# EAGLE board PDU_v2.1 (EAGLE 9.6.2), part 1 of 2
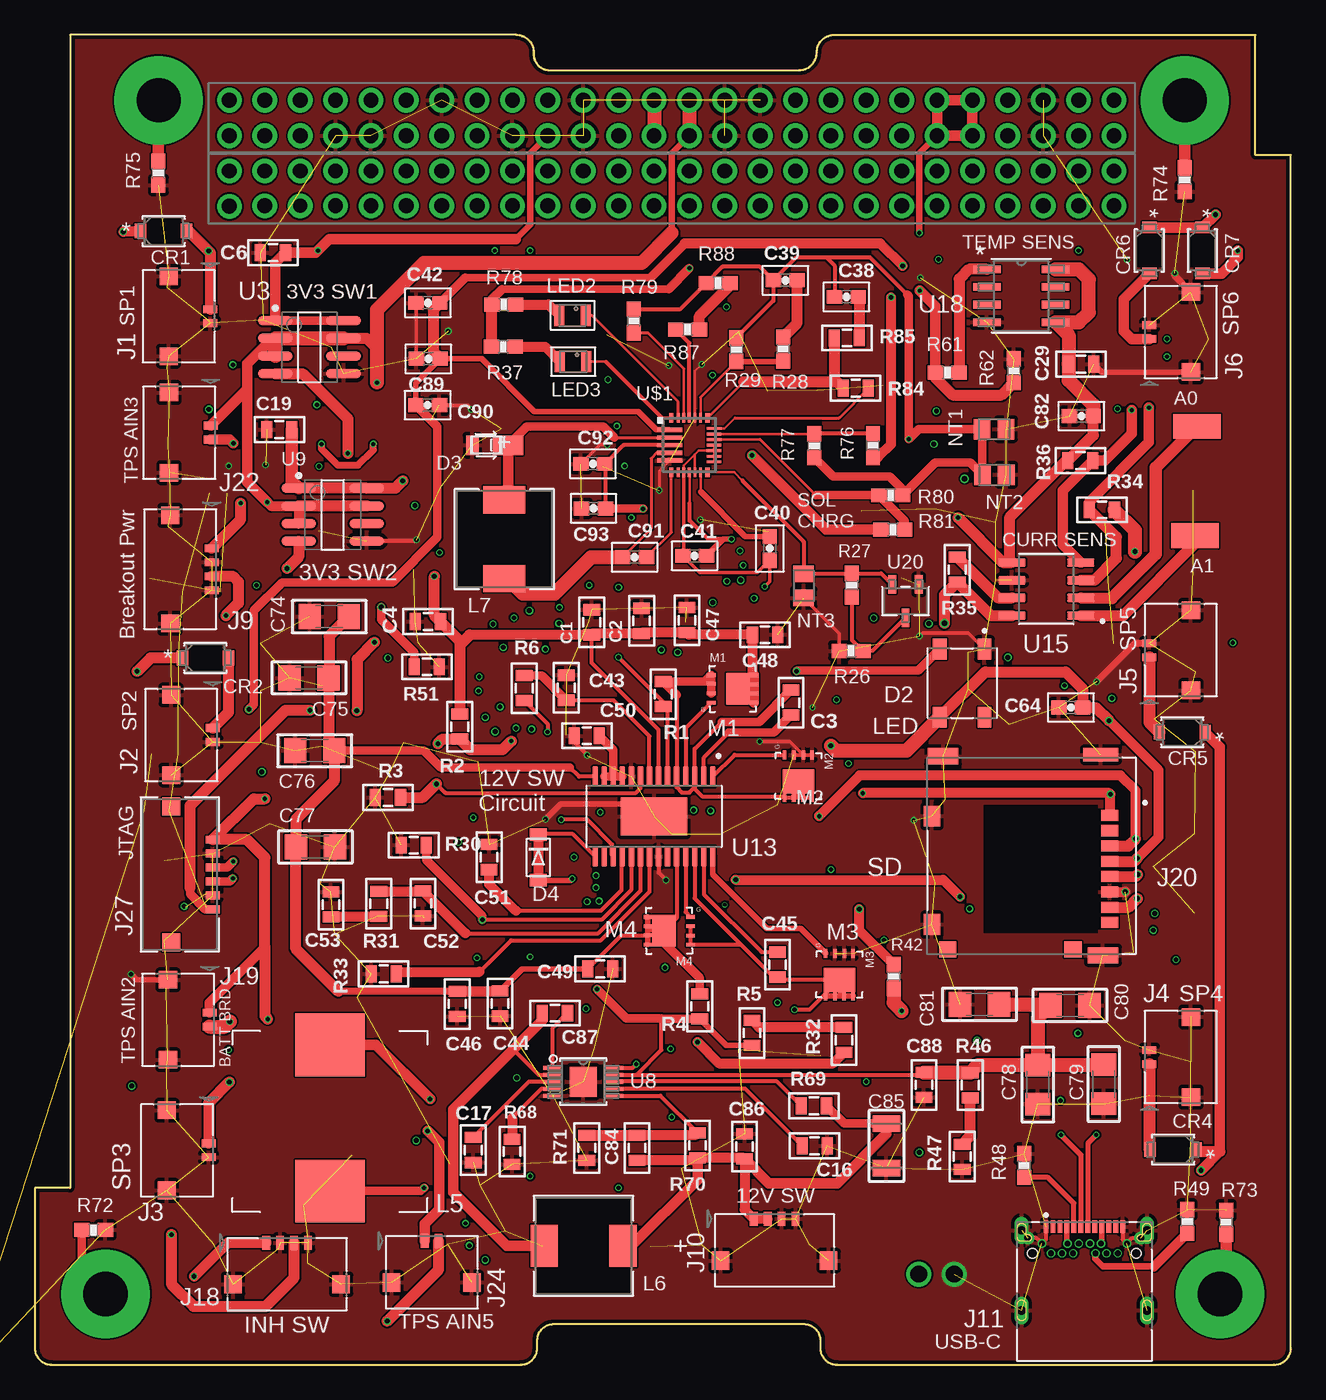
[diagram p12: board, top side]
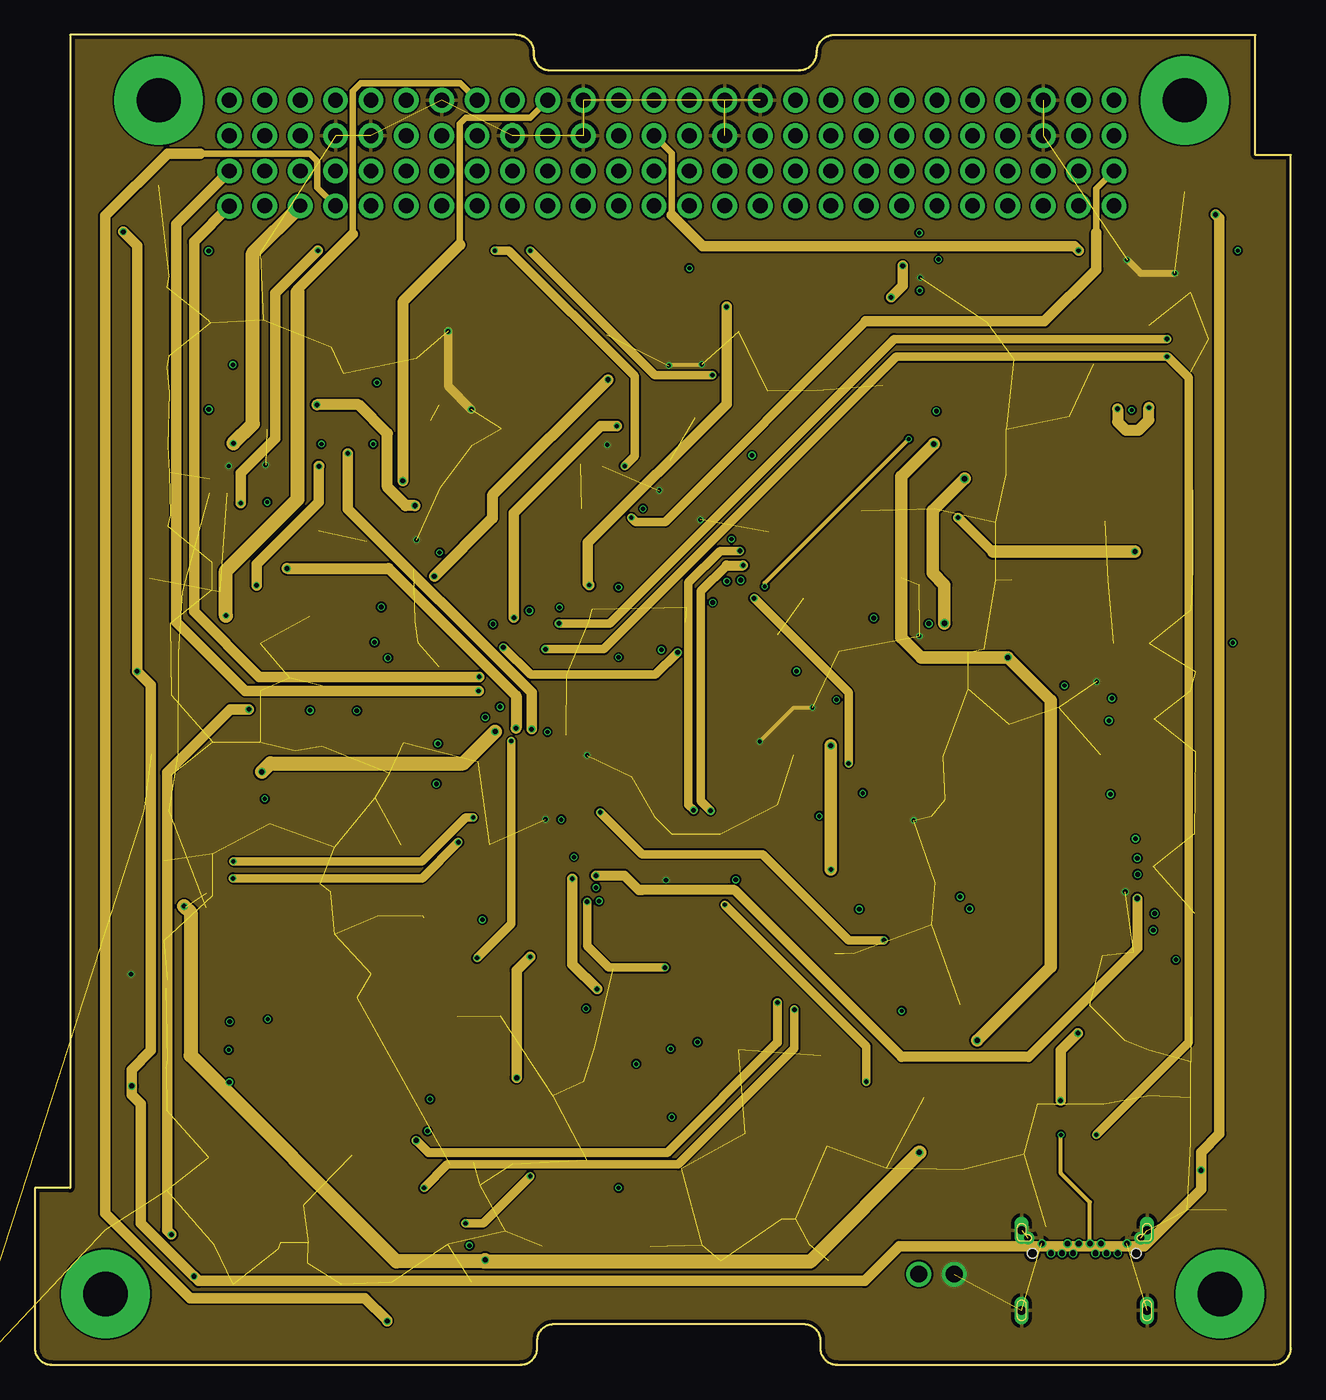
[diagram p13: board, inner layer Route2]
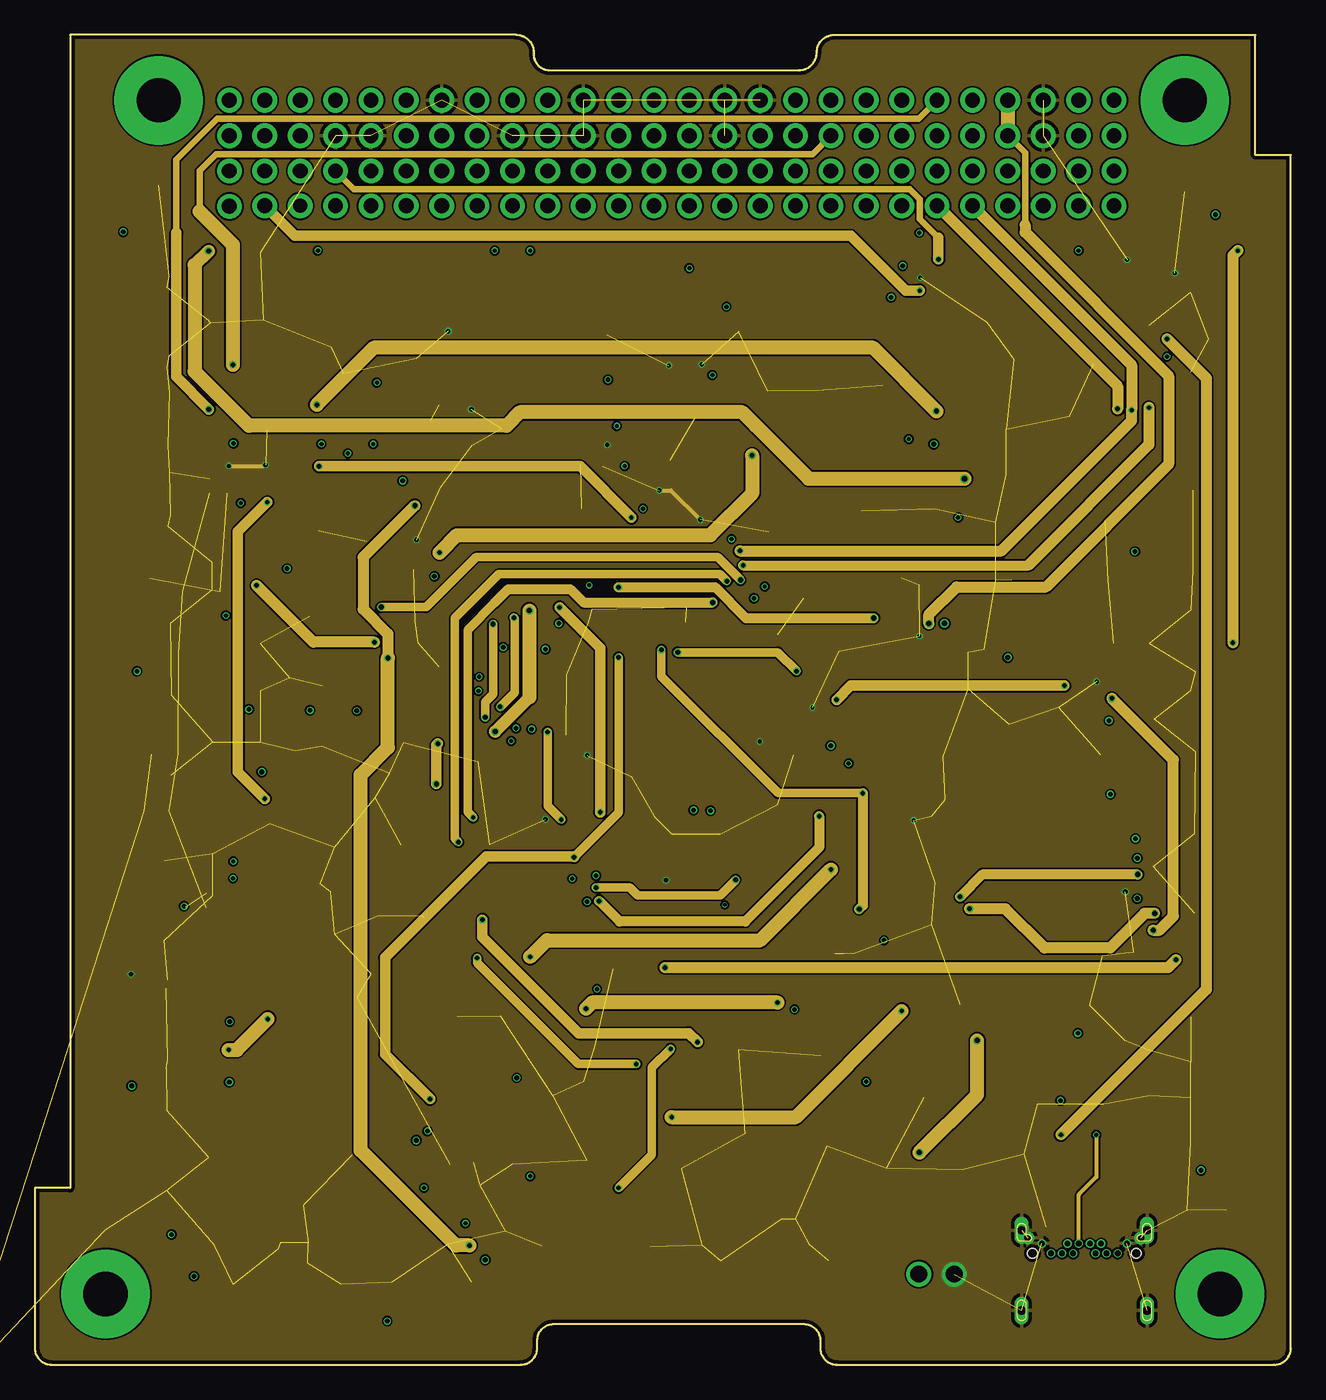
[diagram p14: board, inner layer Route15]
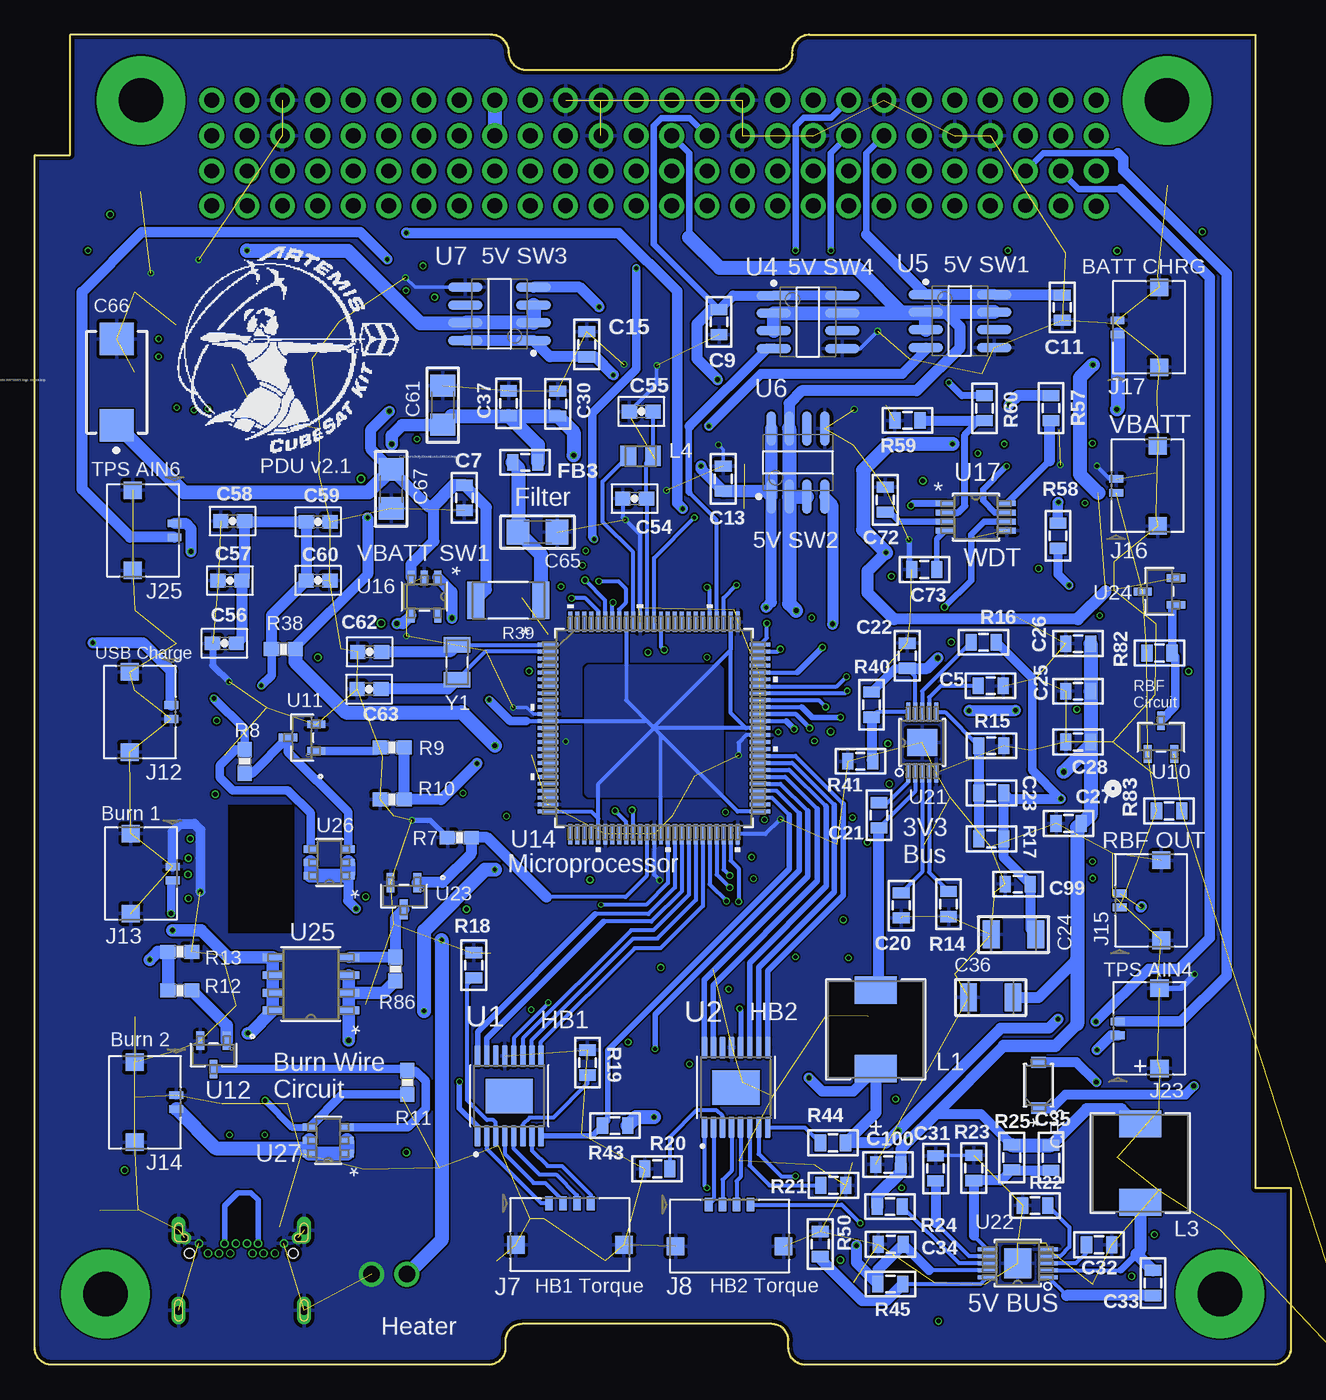
[diagram p15: board, bottom side, seen from below]

Size 90.17 x 95.5 mm. Coordinates in mm from the lower left corner, seen from the top.
Copper layers (1+2*15+16): Top 0.035mm / dielectric 1.5mm / Route2 0.035mm / dielectric 0.15mm / Route15 0.035mm / dielectric 0.2mm / Bottom 0.035mm
Design rules "default *": minimum track width 6mil, minimum drill 5mil, track to track 5mil, track to pad 5mil, pad to pad 5mil, via to via 5mil, smd to smd 5mil, copper to edge 10mil, drill to drill 5mil, minimum pad ring 1mil, minimum via ring 1mil, stop-mask expansion 0mil, vias tented up to drill 0mil, thermal gap 10mil

## Footprints (pad centres in the part's own frame; a part is rotated, then mirrored left to right if it is on the bottom)
0805 = smd 0.8 x 1.2: 1 -0.9,0; 2 0.9,0
1210 = smd 1.2 x 2: 1 -1.6,0; 2 1.6,0
0603-CAP = smd 1.1 x 1: 1 -0.85,0; 2 0.85,0
1206 = smd 1.6 x 1.8: 1 -1.4,0; 2 1.4,0
CAPMP7343X430N = smd 2.35 x 2.45: 1 -3.1,0; 2 3.1,0
CFP3_SOD123W_NEX = smd 0.813 x 1.041: 1 -1.651,0; 2 1.651,0
LED_1655 = smd 1.5 x 1: 1 -2.45,1.6; 2 -2.45,-1.6; 3 2.45,-1.6; 4 2.45,1.6
POWERDI-123 = smd 0.9 x 1.4: A -1.6,0 | smd 2.2 x 1.4: C 0.95,0
SOD-123FL = smd 0.91 x 1.22: A 1.637,0; C -1.637,0
PC104_WCONN = drill 1.067 pad 1.778: 1.1 13.97,83.185; 1.2 13.97,85.725; 1.3 16.51,83.223; 1.4 16.51,85.725; 1.6 19.05,85.725; 1.7 21.59,83.223; 1.8 21.59,85.725; 1.9 24.13,83.223; 1.10 24.13,85.725; 1.11 26.67,83.223; 1.12 26.67,85.725; 1.13 29.21,83.223; 1.14 29.21,85.725; 1.15 31.75,83.223; 1.16 31.75,85.725; 1.17 34.29,83.223; 1.18 34.29,85.725; 1.19 36.83,83.223; 1.20 36.83,85.725; 1.21 39.37,83.223; 1.22 39.37,85.725; 1.23 41.91,83.223; 1.24 41.91,85.725; 1.25 44.45,83.223; 1.26 44.45,85.725; 1.27 46.99,83.223; 1.28 46.99,85.725; 1.29 49.53,83.223; 1.30 49.53,85.725; 1.31 52.07,83.223; 1.32 52.07,85.725; 1.33 54.61,83.223; 1.34 54.61,85.725; 1.35 57.15,83.223; 1.36 57.15,85.725; 1.37 59.69,83.223; 1.38 59.69,85.725; 1.39 62.23,83.223; 1.40 62.23,85.725; 1.41 64.77,83.223; 1.42 64.77,85.725; 1.43 67.31,83.223; 1.44 67.31,85.725; 1.45 69.85,83.223; 1.46 69.85,85.725; 1.47 72.39,83.223; 1.48 72.39,85.725; 1.49 74.93,83.223; 1.50 74.93,85.725; 1.51 77.47,83.223; 1.52 77.47,85.725; 2.1 13.97,88.265; 2.2 13.97,90.805; 2.3 16.51,88.265; 2.4 16.51,90.805; 2.5 19.05,88.265; 2.6 19.05,90.805; 2.7 21.59,88.265; 2.8 21.59,90.805; 2.9 24.13,88.265; 2.10 24.13,90.805; 2.11 26.67,88.265; 2.12 26.67,90.805; 2.13 29.21,88.265; 2.14 29.21,90.805; 2.15 31.75,88.265; 2.16 31.75,90.805; 2.17 34.29,88.265; 2.18 34.29,90.805; 2.19 36.83,88.265; 2.20 36.83,90.805; 2.21 39.37,88.265; 2.22 39.37,90.805; 2.23 41.91,88.265; 2.24 41.91,90.805; 2.25 44.45,88.265; 2.26 44.45,90.805; 2.27 46.99,88.265; 2.28 46.99,90.805; 2.29 49.53,88.265; 2.30 49.53,90.805; 2.31 52.07,88.265; 2.32 52.07,90.805; 2.33 54.61,88.265; 2.34 54.61,90.805; 2.35 57.15,88.265; 2.36 57.15,90.805; 2.37 59.69,88.265; 2.38 59.69,90.805; 2.39 62.23,88.265; 2.40 62.23,90.805; 2.41 64.77,88.265; 2.42 64.77,90.805; 2.43 67.31,88.265; 2.44 67.31,90.805; 2.45 69.85,88.265; 2.46 69.85,90.805; 2.47 72.39,88.265; 2.48 72.39,90.805; 2.49 74.93,88.265; 2.50 74.93,90.805; 2.51 77.47,88.265; 2.52 77.47,90.805 | drill 1.016 pad 1.778: 1.5 19.05,83.223 | drill 3.175 pad 6.35: P$1 5.08,5.08; P$2 85.09,5.08; P$3 82.55,90.805; P$4 8.89,90.805
CON_5037630291 = smd 0.55 x 1: 1 0,0; 2 -1,0 | smd 1.26 x 1.3: 3 2.375,2.99; 4 -3.38,2.99
CON_5037630491 = smd 0.55 x 1: 1 0,0; 2 -1,0; 3 -2,0; 4 -3,0 | smd 1.26 x 1.3: 5 2.375,2.99; 6 -5.38,2.99
CUI_UJ31-CH-G1-SMT-TR = smd 0.35 x 0.89: A1 0,0; A2 0.5,0; A3 1,0; A4 1.5,0; A5 2,0; A6 2.5,0; A7 3,0; A8 3.5,0; A9 4,0; A10 4.5,0; A11 5,0; A12 5.5,0 | drill 0.4 pad 0.6: B1 5.8,-1.205; B2 5.15,-1.905; B3 4.35,-1.905; B4 3.95,-1.205; B5 3.55,-1.905; B6 3.15,-1.205; B7 2.35,-1.205; B8 1.95,-1.905; B9 1.55,-1.205; B10 1.15,-1.905; B11 0.35,-1.905; B12 -0.3,-1.205 | drill 0.6 pad 1 long: SH1 -1.75,-6.005; SH3 -1.75,-0.255; SH4 7.25,-6.005; SH6 7.25,-0.255 | drill 0.5 pad 0.9: SH2 -1.3,-0.805; SH5 6.8,-0.805 | hole 0.7: -0.975,-1.905; 6.475,-1.905
MOLEX_503182-1852 = smd 0.8 x 1.24: 1 -2.9,6.355; 2 -1.8,6.355; 3 -0.7,6.355; 4 0.4,6.355; 5 1.5,6.355; 6 2.6,6.355; 7 3.7,6.355; 8 4.8,6.355 | smd 1.16 x 1.2: DT 6.74,-5.275 | smd 0.95 x 2.5: P1 -7.245,5.725 | smd 1.15 x 2.2: P2 7.145,5.875; P3 -7.145,-5.605 | smd 1.5 x 1.15: P4 -2.84,-6.4; P5 4.94,-6.4 | smd 1.16 x 1.25: SW 6.74,3.725
CONN_503763-0691_MOL = smd 0.559 x 0.991: 1 2.5,-2.368; 2 1.5,-2.368; 3 0.5,-2.368; 4 -0.5,-2.368; 5 -1.5,-2.368; 6 -2.5,-2.368 | smd 1.295 x 1.27: 7 -4.875,0.622; 8 4.875,0.622
IND_222NLT_PUL = smd 1.956 x 2.997: 1 -2.825,0; 2 2.825,0
INDC2012X100N = smd 1.14 x 1.47: 1 -0.89,0; 2 0.89,0
7443551600 = smd 5 x 4.5: P$1 3,2; P$2 3,12.5
LED_0805 = smd 0.711 x 1.524: 1 0,0; 2 1.905,0
BSZ100N06LS3 = smd 0.635 x 0.254: P$1 0.127,0.66; P$2 0.127,1.321; P$3 0.127,2.007; P$4 0.127,2.642; P$5 3.175,2.642; P$6 3.175,1.981; P$7 3.175,1.321; P$8 3.175,0.66 | smd 1.702 x 2.261: P$9 2.032,1.651
INDC2012X105N = smd 1.2 x 1.47: 1 -0.86,0; 2 0.86,0
0603-RES = smd 1.1 x 1: 1 -0.85,0; 2 0.85,0
RESC5025X70N = smd 1.2 x 2.67: 1 -2.335,0; 2 2.335,0
SOP65P640X120-17N = smd 1.57 x 0.41: 1 -2.87,2.275; 2 -2.87,1.625; 3 -2.87,0.975; 4 -2.87,0.325; 5 -2.87,-0.325; 6 -2.87,-0.975; 7 -2.87,-1.625; 8 -2.87,-2.275; 9 2.87,-2.275; 10 2.87,-1.625; 11 2.87,-0.975; 12 2.87,-0.325; 13 2.87,0.325; 14 2.87,0.975; 15 2.87,1.625; 16 2.87,2.275 | smd 2.48 x 3.4: 17 0,0
LINEAR_TECHNOLOGY_LTC1477CS8_2 = smd 2.5 x 0.7: 1 -2.45,1.905; 2 -2.45,0.635; 3 -2.45,-0.635; 4 -2.45,-1.905; 5 2.45,-1.905; 6 2.45,-0.635; 7 2.45,0.635; 8 2.45,1.905
MSOP-10_MSE = smd 1.397 x 0.279: 1 -2.184,1.001; 2 -2.184,0.5; 3 -2.184,0; 4 -2.184,-0.5; 5 -2.184,-1.001; 6 2.184,-1.001; 7 2.184,-0.5; 8 2.184,0; 9 2.184,0.5; 10 2.184,1.001 | smd 1.93 x 2.159: 11 0,0
SOT-23-3L_AOS = smd 0.559 x 1.321: 1 -0.953,-1.194; 2 0.953,-1.194; 3 0,1.194
PG-TO23-3_INF = smd 0.559 x 1.321: 1 -0.953,-1.016; 2 0.953,-1.016; 3 0,1.016
SOP65P640X120-29N = smd 1.48 x 0.41: 1 -2.865,4.225; 2 -2.865,3.575; 3 -2.865,2.925; 4 -2.865,2.275; 5 -2.865,1.625; 6 -2.865,0.975; 7 -2.865,0.325; 8 -2.865,-0.325; 9 -2.865,-0.975; 10 -2.865,-1.625; 11 -2.865,-2.275; 12 -2.865,-2.925; 13 -2.865,-3.575; 14 -2.865,-4.225; 15 2.865,-4.225; 16 2.865,-3.575; 17 2.865,-2.925; 18 2.865,-2.275; 19 2.865,-1.625; 20 2.865,-0.975; 21 2.865,-0.325; 22 2.865,0.325; 23 2.865,0.975; 24 2.865,1.625; 25 2.865,2.275; 26 2.865,2.925; 27 2.865,3.575; 28 2.865,4.225 | smd 2.74 x 4.75: 29 0,0
TQFP100_14X14MC_MCH = smd 1.473 x 0.279: 1 -7.62,6; 2 -7.62,5.5; 3 -7.62,5; 4 -7.62,4.5; 5 -7.62,4; 6 -7.62,3.5; 7 -7.62,3; 8 -7.62,2.5; 9 -7.62,2; 10 -7.62,1.5; 11 -7.62,1; 12 -7.62,0.5; 13 -7.62,0; 14 -7.62,-0.5; 15 -7.62,-1; 16 -7.62,-1.5; 17 -7.62,-2; 18 -7.62,-2.5; 19 -7.62,-3; 20 -7.62,-3.5; 21 -7.62,-4; 22 -7.62,-4.5; 23 -7.62,-5; 24 -7.62,-5.5; 25 -7.62,-6; 51 7.62,-6; 52 7.62,-5.5; 53 7.62,-5; 54 7.62,-4.5; 55 7.62,-4; 56 7.62,-3.5; 57 7.62,-3; 58 7.62,-2.5; 59 7.62,-2; 60 7.62,-1.5; 61 7.62,-1; 62 7.62,-0.5; 63 7.62,0; 64 7.62,0.5; 65 7.62,1; 66 7.62,1.5; 67 7.62,2; 68 7.62,2.5; 69 7.62,3; 70 7.62,3.5; 71 7.62,4; 72 7.62,4.5; 73 7.62,5; 74 7.62,5.5; 75 7.62,6 | smd 0.279 x 1.473: 26 -6,-7.62; 27 -5.5,-7.62; 28 -5,-7.62; 29 -4.5,-7.62; 30 -4,-7.62; 31 -3.5,-7.62; 32 -3,-7.62; 33 -2.5,-7.62; 34 -2,-7.62; 35 -1.5,-7.62; 36 -1,-7.62; 37 -0.5,-7.62; 38 0,-7.62; 39 0.5,-7.62; 40 1,-7.62; 41 1.5,-7.62; 42 2,-7.62; 43 2.5,-7.62; 44 3,-7.62; 45 3.5,-7.62; 46 4,-7.62; 47 4.5,-7.62; 48 5,-7.62; 49 5.5,-7.62; 50 6,-7.62; 76 6,7.62; 77 5.5,7.62; 78 5,7.62; 79 4.5,7.62; 80 4,7.62; 81 3.5,7.62; 82 3,7.62; 83 2.5,7.62; 84 2,7.62; 85 1.5,7.62; 86 1,7.62; 87 0.5,7.62; 88 0,7.62; 89 -0.5,7.62; 90 -1,7.62; 91 -1.5,7.62; 92 -2,7.62; 93 -2.5,7.62; 94 -3,7.62; 95 -3.5,7.62; 96 -4,7.62; 97 -4.5,7.62; 98 -5,7.62; 99 -5.5,7.62; 100 -6,7.62
SOIC127P599X175-8N = smd 1.97 x 0.6: 1 -2.47,1.905; 2 -2.47,0.635; 3 -2.47,-0.635; 4 -2.47,-1.905; 5 2.47,-1.905; 6 2.47,-0.635; 7 2.47,0.635; 8 2.47,1.905
SOT-23-5_M5_MCH = smd 0.978 x 0.508: 1 -1.365,0.95; 2 -1.365,0; 3 -1.365,-0.95; 4 1.365,-0.95; 5 1.365,0.95
21-0036K_MXM = smd 1.321 x 0.406: 1 -2.21,0.975; 2 -2.21,0.325; 3 -2.21,-0.325; 4 -2.21,-0.975; 5 2.21,-0.975; 6 2.21,-0.325; 7 2.21,0.325; 8 2.21,0.975
R_8_ADI = smd 1.981 x 0.559: 1 -2.464,1.905; 2 -2.464,0.635; 3 -2.464,-0.635; 4 -2.464,-1.905; 5 2.464,-1.905; 6 2.464,-0.635; 7 2.464,0.635; 8 2.464,1.905
SOT-23_ONS = smd 0.559 x 1.422: 1 -0.953,-0.965; 2 0.953,-0.965; 3 0,0.965
SOIC_DY-T1-GE3_VIS = smd 1.46 x 0.559: 1 -2.724,1.905; 2 -2.724,0.635; 3 -2.724,-0.635; 4 -2.724,-1.905; 5 2.724,-1.905; 6 2.724,-0.635; 7 2.724,0.635; 8 2.724,1.905
6TSOP_VIS = smd 0.991 x 0.508: 1 -1.346,0.95; 2 -1.346,0; 3 -1.346,-0.95; 4 1.346,-0.95; 5 1.346,0; 6 1.346,0.95
QFN26-4X4_MP2639A = smd 1.8 x 0.3: 1 -1.4,1.1; 2 -1.4,0.55; 3 -1.4,0; 4 -1.4,-0.55; 5 -1.4,-1.1 | smd 0.3 x 0.7: 6 -1.3,-1.95; 12 1.3,-1.95; 20 1.3,1.95; 26 -1.3,1.95 | smd 0.2 x 0.7: 7 -0.8,-1.95; 8 -0.4,-1.95; 9 0,-1.95; 10 0.4,-1.95; 11 0.8,-1.95; 21 0.8,1.95; 22 0.4,1.95; 23 0,1.95; 24 -0.4,1.95; 25 -0.8,1.95 | smd 1.05 x 0.2: 13 1.775,-1.2; 14 1.775,-0.8; 15 1.775,-0.4; 16 1.775,0; 17 1.775,0.4; 18 1.775,0.8; 19 1.775,1.2
TEST_POINT = smd 3.429 x 1.778: 1 0,0
XTAL_ABS07-32.768KHZ-T = smd 1.1 x 1.9: 1 -1.25,0; 2 1.25,0

## Placement (x,y rotation side)
C1  22 uF  [0805]  39.98,53.31 90 top
C2  22 uF  [0805]  43.56,53.42 90 top
C3  0.1 uF  [0805]  54.28,47.55 270 top
C4  1 uF  [0805]  28.22,53.37 180 top
C5  0.1 uF  [0805]  21.55,48.75 0 bottom
C6  1 uF  [0805]  17.09,79.86 180 top
C7  0.1 uF  [0805]  59.33,62.26 270 bottom
C9  1 uF  [0805]  41.05,74.88 270 bottom
C11  1 uF  [0805]  16.41,75.92 270 bottom
C13  1 uF  [0805]  40.74,63.63 90 bottom
C15  1 uF  [0805]  50.55,73.28 90 bottom
C16  0.1 uF  [0805]  55.98,15.72 0 top
C17  1 uF  [0805]  31.47,15.42 270 top
C19  1 uF  [0805]  17.55,67.16 180 top
C20  1 uF  [0805]  27.97,32.98 270 bottom
C21  0.1 uF  [0805]  29.57,39.45 270 bottom
C22  4.7 uF  [0805]  27.54,50.91 90 bottom
C23  10 pF  [0805]  21.51,41.06 0 bottom
C24  47 uF  [1210]  19.91,30.89 180 bottom
C25  0.1 uF  [0805]  15.27,48.37 0 bottom
C26  10 uF  [0805]  15.27,51.78 0 bottom
C27  0.1 uF  [0805]  15.96,38.87 0 bottom
C28  10 uF  [0805]  15.27,44.71 0 bottom
C29  0.1 uF  [0805]  75.11,71.86 0 top
C30  1 uF  [0805]  52.63,69.01 90 bottom
C31  0.1 uF  [0805]  25.5,14.1 90 bottom
C32  1 uF  [0805]  13.77,8.61 0 bottom
C33  0.1 uF  [0805]  9.91,5.87 90 bottom
C34  4.7 uF  [0805]  28.73,8.64 180 bottom
C35  10 pF  [0805]  17.22,14.86 90 bottom
C36  47 uF  [1210]  21.54,26.37 180 bottom
C37  0.1 uF  [0805]  56.16,69.04 90 bottom
C38  1 uF  [0603-CAP]  58.27,76.68 0 top
C39  33 pF  [0603-CAP]  53.87,77.88 0 top
C40  0.1 uF  [0603-CAP]  52.76,58.62 270 top
C41  1 uF  [0603-CAP]  47.37,58.09 180 top
C42  4.7 uF  [0603-CAP]  28.22,76.25 0 top
C43  4.7 uF  [0805]  38.15,48.62 90 top
C44  1uF  [0805]  33.4,25.93 270 top
C45  0.1 uF  [0805]  53.31,28.73 90 top
C46  10 uF  [0805]  30.33,25.91 270 top
C47  4.7 uF  [0805]  46.81,53.47 90 top
C48  4.7 uF  [0805]  52.43,52.43 0 top
C49  10 uF  [0805]  40.59,28.42 0 top
C50  0.47 uF  [0805]  39.62,45.16 180 top
C51  0.1 uF  [0805]  32.61,36.45 90 top
C52  100 pF  [0805]  27.86,33.12 270 top
C53  4.7 nF  [0805]  21.26,33.05 90 top
C54  10 uF  [0603-CAP]  47.12,62.2 180 bottom
C55  1 uF  [0603-CAP]  46.63,68.45 180 bottom
C56  10 uF  [0603-CAP]  76.56,51.81 180 bottom
C57  1 uF  [0603-CAP]  76.17,56.31 180 bottom
C58  1 uF  [0603-CAP]  75.97,60.59 180 bottom
C59  0.1 uF  [0603-CAP]  69.82,60.53 0 bottom
C60  0.1 uF  [0603-CAP]  69.83,56.32 0 bottom
C61  4.7 uF  [1206]  60.88,68.91 90 bottom
C62  22 pF  [0603-CAP]  66.14,51.19 0 bottom
C63  22 pF  [0603-CAP]  66.18,48.51 0 bottom
C64  0.1 uF  [0603-CAP]  74.37,47.19 180 top
C65  4.7 uF  [1206]  54.08,59.79 0 bottom
C66  22 uF  [CAPMP7343X430N]  84.28,70.56 90 bottom
C67  4.7 uF  [1206]  64.59,62.89 270 bottom
C72  0.1 uF  [0805]  29.13,62.12 270 bottom
C73  1 uF  [0805]  26.31,57.1 180 bottom
C74  33 uF  [1206]  21.13,53.72 180 top
C75  33 uF  [1206]  19.68,49.33 180 top
C76  33 uF  [1206]  20.09,44.09 180 top
C77  33 uF  [1206]  20.14,37.19 0 top
C78  33 uF  [1206]  72.01,20.12 270 top
C79  33 uF  [1206]  76.73,20.14 270 top
C80  33 uF  [1206]  74.32,25.81 0 top
C81  33 uF  [1206]  67.82,25.88 180 top
C82  0.1 uF  [0603-CAP]  75.13,68.12 0 top
C84  10 pF  [0805]  43.23,15.57 270 top
C85  47 uF  [1210]  61.14,15.72 270 top
C86  4.7 uF  [0805]  50.95,15.67 90 top
C87  0.1 uF  [0805]  37.34,25.25 180 top
C88  4.7 uF  [0805]  63.83,20.09 270 top
C89  10 uF  [0603-CAP]  28.24,72.24 0 top
C90  4.7 uF  [0603-CAP]  28.19,68.91 180 top
C91  0.1 uF  [0603-CAP]  43.05,57.99 0 top
C92  10 uF  [0603-CAP]  40.06,64.69 0 top
C93  1 uF  [0603-CAP]  40.11,61.49 0 top
C99  4.7 uF  [0805]  19.6,34.51 180 bottom
C100  4.7 uF  [0805]  28.91,14.38 180 bottom
CR1  PMEG10020ELRX  [CFP3_SOD123W_NEX]  9.25,81.41 0 top
CR2  PMEG10020ELRX  [CFP3_SOD123W_NEX]  12.24,50.75 0 top
CR3  PMEG10020ELRX  [CFP3_SOD123W_NEX]  18.11,20.07 90 bottom
CR4  PMEG10020ELRX  [CFP3_SOD123W_NEX]  81.71,15.44 180 top
CR5  PMEG10020ELRX  [CFP3_SOD123W_NEX]  82.37,45.42 180 top
CR6  PMEG10020ELRX  [CFP3_SOD123W_NEX]  80.01,80.01 270 top
CR7  PMEG10020ELRX  [CFP3_SOD123W_NEX]  83.82,80.01 270 top
D2  1655  [LED_1655]  66.57,48.95 270 top
D3  SBR2A40P1Q-7  [POWERDI-123]  33.02,66.04 0 top
D4  [SOD-123FL]  36.14,36.42 270 top
FB3  330  [0805]  54.97,64.8 180 bottom
H1  PC104_WCONN  [PC104_WCONN]  0,0 0 top
J1  5037630291  [CON_5037630291]  12.6,75.79 90 top
J2  5037630291  [CON_5037630291]  12.78,45.72 90 top
J3  5037630291  [CON_5037630291]  12.47,15.9 90 top
J4  5037630291  [CON_5037630291]  80.01,21.59 270 top
J5  5037630291  [CON_5037630291]  80.01,50.8 270 top
J6  5037630291  [CON_5037630291]  80.01,73.66 270 top
J7  5037630491  [CON_5037630491]  53.26,11.6 180 bottom
J8  5037630491  [CON_5037630491]  41.79,11.5 180 bottom
J9  5037630491  [CON_5037630491]  12.7,58.62 90 top
J10  5037630491  [CON_5037630491]  51.61,10.46 180 top
J11  UJ31-CH-G1-SMT-TR  [CUI_UJ31-CH-G1-SMT-TR]  72.59,9.91 0 top
J12  5037630291  [CON_5037630291]  80.37,47.37 90 bottom
J13  5037630291  [CON_5037630291]  80.28,35.77 90 bottom
J14  5037630291  [CON_5037630291]  80.01,19.35 90 bottom
J15  5037630291  [CON_5037630291]  12.29,32.84 270 bottom
J16  5037630291  [CON_5037630291]  12.55,62.61 270 bottom
J17  5037630291  [CON_5037630291]  12.45,74 270 bottom
J18  5037630491  [CON_5037630491]  16.61,8.76 180 top
J19  5037630291  [CON_5037630291]  12.55,25.27 90 top
J20  503182-1852  [MOLEX_503182-1852]  70.81,36.55 270 top
J22  5037630291  [CON_5037630291]  12.62,67.44 90 top
J23  5037630291  [CON_5037630291]  12.42,23.65 270 bottom
J24  5037630291  [CON_5037630291]  27.99,8.89 180 top
J25  5037630291  [CON_5037630291]  80.15,60.43 90 bottom
J27  5037630691  [CONN_503763-0691_MOL]  10.41,35.2 90 top
L1  PA4341.222NLT  [IND_222NLT_PUL]  29.79,24.08 90 bottom
L3  PA4341.222NLT  [IND_222NLT_PUL]  10.82,14.48 270 bottom
L4  10 uH  [INDC2012X100N]  46.69,65.25 180 bottom
L5  6 uH  [7443551600]  24.18,24.97 180 top
L6  PA4341.222NLT  [IND_222NLT_PUL]  39.4,8.53 180 top
L7  PA4341.222NLT  [IND_222NLT_PUL]  33.71,59.28 270 top
LED2  LED_0805  [LED_0805]  37.64,75.36 0 top
LED3  LED_0805  [LED_0805]  37.69,72.03 0 top
M1  BSZ100N06LS3  [BSZ100N06LS3]  48.44,46.89 0 top
M2  BSZ100N06LS3  [BSZ100N06LS3]  53.16,43.92 270 top
M3  BSZ033NE2LS5  [BSZ100N06LS3]  56.11,29.67 270 top
M4  BSZ033NE2LS5  [BSZ100N06LS3]  47.19,32.82 180 top
NT1  AIMC-0805-2N2S-T  [INDC2012X105N]  68.86,67.18 180 top
NT2  AIMC-0805-2N2S-T  [INDC2012X105N]  68.88,63.91 180 top
NT3  AIMC-0805-2N2S-T  [INDC2012X105N]  55.19,55.93 90 top
NT4  AIMC-0805-2N2S-T  [INDC2012X105N]  -7.11,-4.17 0 top  (outside the outline)
R1  4 m  [0805]  45.11,48.16 90 top
R2  390 k  [0805]  30.51,45.82 90 top
R3  180 k  [0805]  25.35,40.74 0 top
R4  15 m  [0805]  47.73,25.73 270 top
R5  130 k  [0805]  51.49,23.83 270 top
R6  100 k  [0805]  35.13,48.59 90 top
R7  10 k  [0603-RES]  59.69,37.85 0 bottom
R8  100 k  [0603-RES]  75.1,43.32 90 bottom
R9  4.7 k  [0603-RES]  64.52,44.32 0 bottom
R10  10 k  [0603-RES]  64.52,40.59 180 bottom
R11  100 k  [0603-RES]  63.42,20.26 270 bottom
R12  4.7 k  [0603-RES]  79.76,26.87 180 bottom
R13  10 k  [0603-RES]  79.76,29.65 0 bottom
R14  18.2 k  [0805]  24.58,33.08 90 bottom
R15  309 k  [0805]  21.51,44.45 180 bottom
R16  47 k  [0805]  22.06,51.88 0 bottom
R17  1 M  [0805]  21.51,37.76 0 bottom
R18  330 m  [0805]  58.66,28.69 270 bottom
R19  330 m  [0805]  50.5,21.69 270 bottom
R20  330 m  [0805]  45.49,14.07 0 bottom
R21  330 m  [0805]  32.84,12.88 180 bottom
R22  18.2 k  [0805]  18.36,11.43 0 bottom
R23  187 k  [0805]  22.76,14.12 270 bottom
R24  47 k  [0805]  28.79,11.35 180 bottom
R25  1 M  [0805]  20.04,14.88 90 bottom
R26  1 k  [0603-RES]  58.6,51.26 0 top
R27  100  [0603-RES]  58.65,55.98 270 top
R28  10 k  [0603-RES]  53.72,72.95 270 top
R29  40.2 k  [0603-RES]  50.37,72.9 270 top
R30  10 k  [0805]  27.2,37.31 0 top
R31  27 k  [0805]  24.69,33.1 90 top
R32  10 k  [0805]  58.09,23.32 90 top
R33  100 k  [0805]  25.04,28.07 0 top
R34  3.3 k  [0805]  76.61,61.39 180 top
R35  2 m  [0805]  66.22,57.1 90 top
R36  3.3 k  [0805]  75.06,64.92 0 top
R37  2 k  [0603-RES]  33.63,73.1 0 top
R38  10 k  [0603-RES]  72.32,51.38 0 bottom
R39  0  [RESC5025X70N]  56.18,54.89 180 bottom
R40  0  [0805]  30.1,47.4 90 bottom
R41  1 M  [0805]  30.91,43.33 0 bottom
R42  10 k  [0603-RES]  61.65,27.89 270 top
R43  3.3 k  [0805]  48.51,17.17 180 bottom
R44  3.3 k  [0805]  32.87,15.93 180 bottom
R45  0  [0805]  28.75,5.79 180 bottom
R46  510 k  [0805]  67.16,20.07 270 top
R47  270 k  [0805]  66.57,14.94 90 top
R48  5.1 k  [0603-RES]  71.02,14.3 270 top
R49  5.1 k  [0603-RES]  82.73,10.29 270 top
R50  1 M  [0805]  33.78,8.66 270 bottom
R51  10 k  [0805]  28.14,50.11 180 top
R57  10 k  [0805]  17.22,68.7 90 bottom
R58  2 k  [0805]  16.72,59.53 90 bottom
R59  100 k  [0805]  27.52,67.81 0 bottom
R60  63.4 k  [0805]  22,68.69 90 bottom
R61  45.3 k  [0603-RES]  65.51,71.25 0 top
R62  10 k  [0603-RES]  70.28,71.37 270 top
R68  40.2 k  [0805]  34.26,15.29 90 top
R69  100 k  [0805]  55.93,18.59 0 top
R70  1 M  [0805]  47.57,15.75 270 top
R71  69.8 k  [0805]  39.62,15.57 90 top
R72  1 M  [0603-RES]  4.22,9.68 180 top
R73  1 M  [0603-RES]  85.52,10.24 270 top
R74  1 M  [0603-RES]  82.55,85.09 90 top
R75  1 M  [0603-RES]  8.86,85.57 90 top
R76  27.4 k  [0603-RES]  60.17,66.01 90 top
R77  10 k  [0603-RES]  55.96,65.99 270 top
R78  2 k  [0603-RES]  33.66,76.14 180 top
R79  68.1 k  [0603-RES]  43,74.96 90 top
R80  1 k  [0603-RES]  61.44,62.43 0 top
R81  1 k  [0603-RES]  61.59,59.97 180 top
R82  1 M  [0805]  9.43,51.1 180 bottom
R83  1 M  [0805]  8.74,39.77 0 bottom
R84  10 k  [0805]  58.93,70.13 0 top
R85  15 k  [0805]  58.29,73.74 180 top
R86  10 k  [0603-RES]  64.29,28.41 270 bottom
R87  1 M  [0603-RES]  46.86,74.35 0 top
R88  150 k  [0603-RES]  49.05,77.67 180 top
U1  DRV8847PWPR  [SOP65P640X120-17N]  56.11,19.3 90 bottom
U2  DRV8847PWPR  [SOP65P640X120-17N]  39.83,19.91 90 bottom
U3  LTC1477CS8LINEAR_TECHNOLOGY_LTC1477CS8_0_2  [LINEAR_TECHNOLOGY_LTC1477CS8_2]  19.71,73.08 0 top
U4  LTC1477CS8LINEAR_TECHNOLOGY_LTC1477CS8_0_2  [LINEAR_TECHNOLOGY_LTC1477CS8_2]  34.67,74.88 0 bottom
U5  LTC1477CS8LINEAR_TECHNOLOGY_LTC1477CS8_0_2  [LINEAR_TECHNOLOGY_LTC1477CS8_2]  23.75,74.96 0 bottom
U6  LTC1477CS8LINEAR_TECHNOLOGY_LTC1477CS8_0_2  [LINEAR_TECHNOLOGY_LTC1477CS8_2]  35.38,64.79 90 bottom
U7  LTC1477CS8LINEAR_TECHNOLOGY_LTC1477CS8_0_2  [LINEAR_TECHNOLOGY_LTC1477CS8_2]  56.82,75.46 180 bottom
U8  LT8609A  [MSOP-10_MSE]  39.37,20.32 0 top
U9  LTC1477CS8LINEAR_TECHNOLOGY_LTC1477CS8_0_2  [LINEAR_TECHNOLOGY_LTC1477CS8_2]  21.39,61.04 0 top
U10  AO3404A  [SOT-23-3L_AOS]  9.33,45.05 0 bottom
U11  IRLML2803PBFCT-ND  [PG-TO23-3_INF]  70.98,45.03 90 bottom
U12  IRLML2803PBFCT-ND  [PG-TO23-3_INF]  77.34,22.25 180 bottom
U13  LT8390EFE#PBF  [SOP65P640X120-29N]  44.45,39.37 270 top
U14  ATSAME51N19A-AF  [TQFP100_14X14MC_MCH]  45.72,45.72 0 bottom
U15  INA219BIDR  [SOIC127P599X175-8N]  72.62,55.7 180 top
U16  MIC2514YM5-TR  [SOT-23-5_M5_MCH]  62.2,55.17 270 bottom
U17  MAX16998AAUA+T  [21-0036K_MXM]  22.61,60.87 0 bottom
U18  TMP36FSZ  [R_8_ADI]  70.82,76.76 0 top
U20  AO3404A  [SOT-23-3L_AOS]  62.51,54.84 180 top
U21  LT8609A  [MSOP-10_MSE]  26.47,44.68 90 bottom
U22  LT8609A  [MSOP-10_MSE]  19.61,7.29 180 bottom
U23  BC848ALT1G  [SOT-23_ONS]  63.68,33.66 180 bottom
U24  AO3404A  [SOT-23-3L_AOS]  9.44,55.53 90 bottom
U25  SI4835DDY-T1-GE3  [SOIC_DY-T1-GE3_VIS]  70.35,27.34 180 bottom
U26  SI3493DDV-T1-GE3  [6TSOP_VIS]  69.03,36.07 180 bottom
U27  SI3493DDV-T1-GE3  [6TSOP_VIS]  69.1,16.11 180 bottom
U$1  MP2639A  [QFN26-4X4_MP2639A]  46.99,66.04 0 top
U$2  TEST_POINT  [TEST_POINT]  83.44,67.39 0 top
U$4  TEST_POINT  [TEST_POINT]  83.29,59.54 0 top
Y1  ABS07-32.768KHZ-T  [XTAL_ABS07-32.768KHZ-T]  59.85,50.44 90 bottom